# EAGLE design openSX70-dongle_v5-1-dual-led (EAGLE 9.4.2)
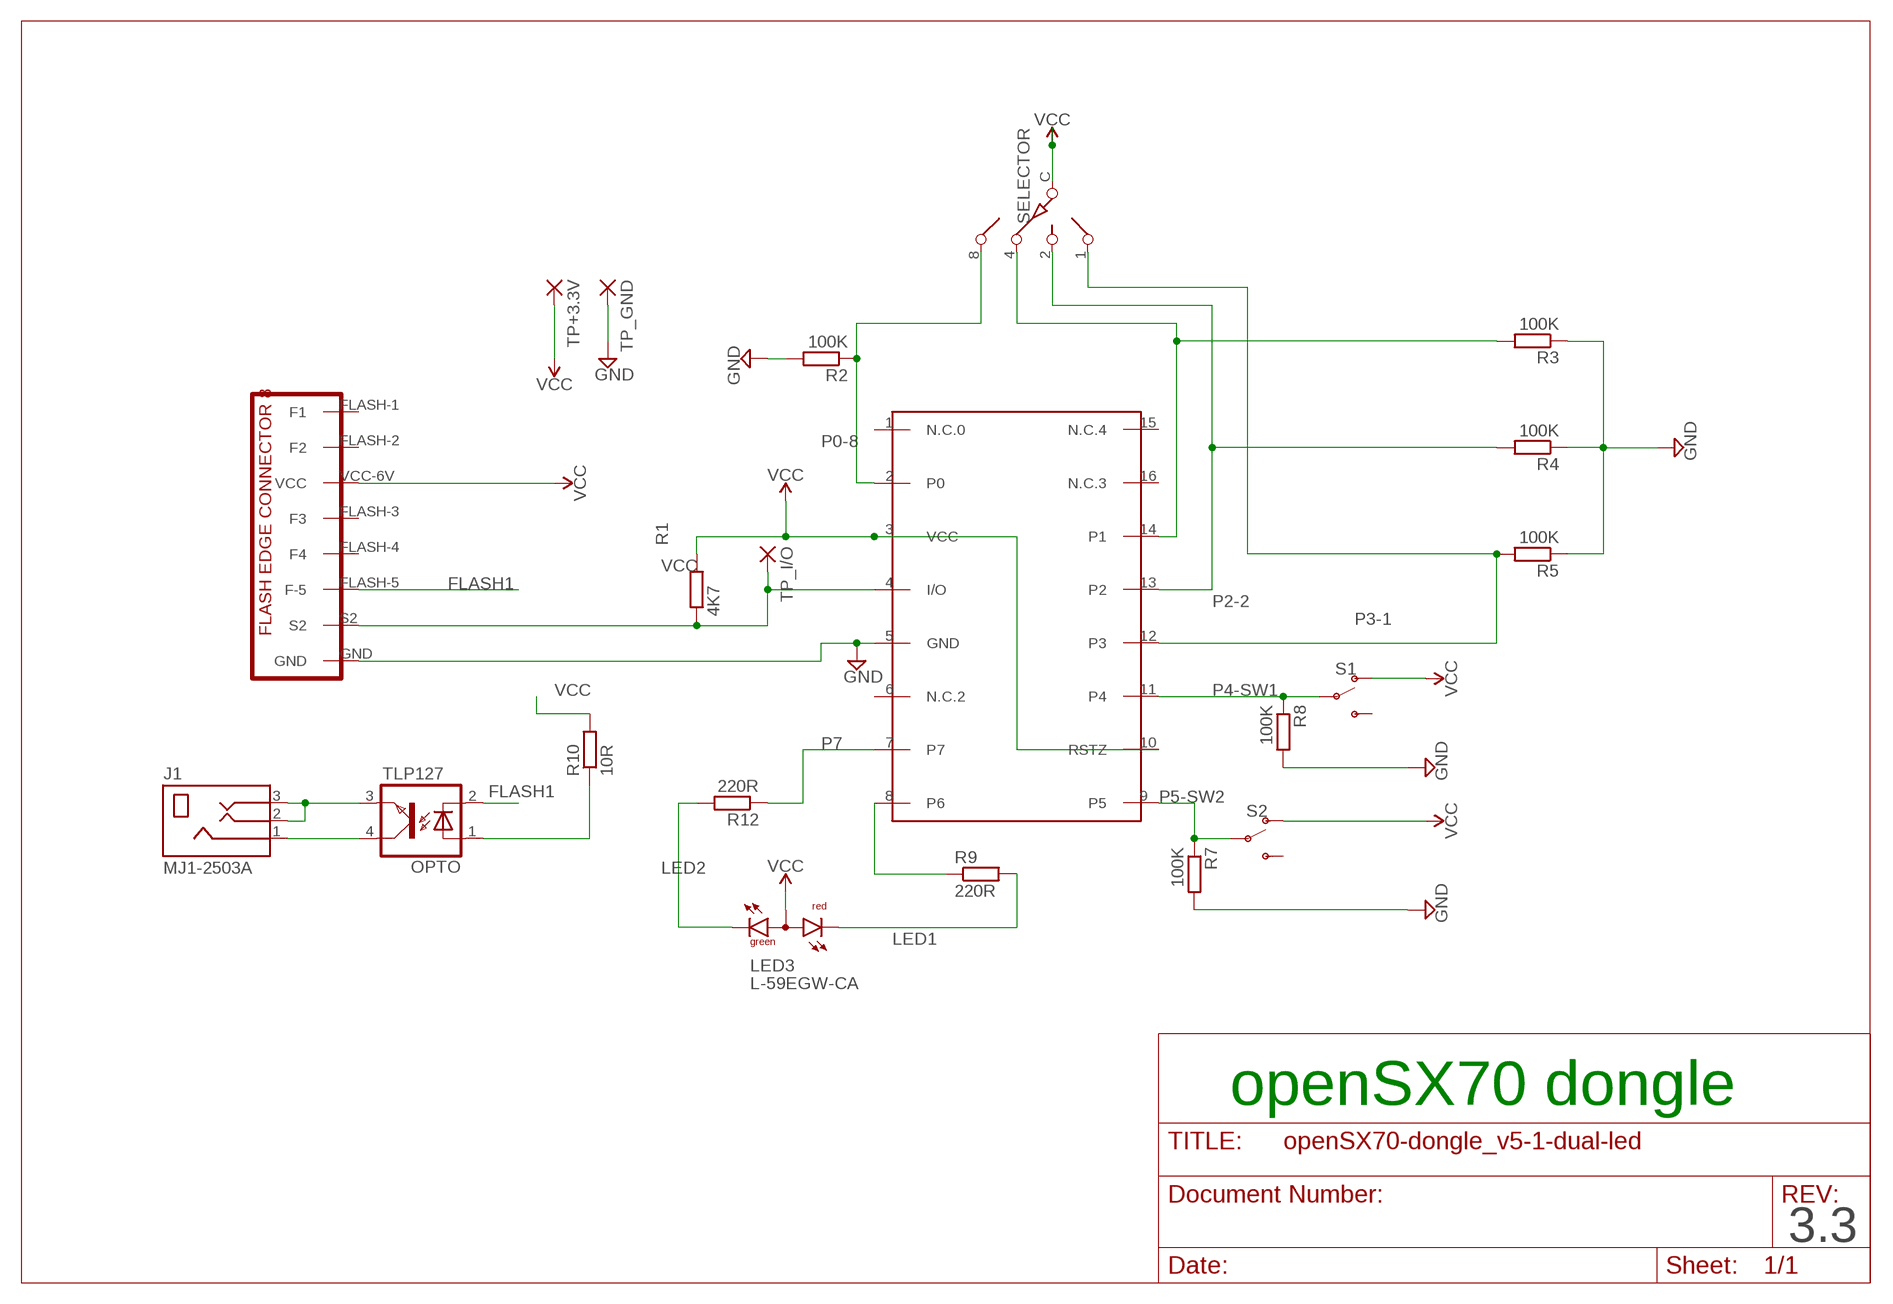
[diagram p0: schematic, sheet 1]

## Parts
DS2408  DS2408  [SO16]
J1  MJ1-2503A  [CUI_MJ1-2503A]
LED3  L-59EGW-CA  [L-59EGW-CA]
OPTO  TLP127  [SO-4]
R1  4K7  R-EU_R0603  [R0603]
R2  100K  R-EU_R0603  [R0603]
R3  100K  R-EU_R0603  [R0603]
R4  100K  R-EU_R0603  [R0603]
R5  100K  R-EU_R0603  [R0603]
R7  100K  R-EU_R0603  [R0603]
R8  100K  R-EU_R0603  [R0603]
R9  220R  R-EU_R0603  [R0603]
R10  10R  R-EU_R0603  [R0603]
R12  220R  R-EU_R0603  [R0603]
S1  SWITCH-SPDT-SMD-RIGHT-ANGLE  [SWITCH_SPST_SMD_A]
S2  SWITCH-SPDT-SMD-RIGHT-ANGLE  [SWITCH_SPST_SMD_A]
SELECTOR  SW-C16  [SW-C16]
TP+3.3V  SMD2  [SMD1,27-2,54]
TP_GND  SMD2  [SMD1,27-2,54]
TP_I/O  SMD2  [SMD1,27-2,54]
U$2  SX70-FLASH-EDGE8-MALE-PROPER  [SX70-FLASH-EDGE8]

## Nets
FLASH1: OPTO.2(C) U$2.FLASH-5(F-5)
GND: DS2408.5(GND) R2.2 R3.1 R4.1 R5.1 R7.2 R8.2 TP_GND.1(P) U$2.GND
LED1: LED3.1(CR) R9.2
LED2: LED3.3(CG) R12.2
N$9: J1.1 OPTO.4(COL)
N$12: OPTO.1(A) R10.1
N$15: J1.2 J1.3 OPTO.3(EMIT)
P0-8: DS2408.2(P0) R2.1 SELECTOR.8
P1-4: DS2408.14(P1) R3.2 SELECTOR.4
P2-2: DS2408.13(P2) R4.2 SELECTOR.2
P3-1: DS2408.12(P3) R5.2 SELECTOR.1
P4-SW1: DS2408.11(P4) R8.1 S1.2(P)
P5-SW2: DS2408.9(P5) R7.1 S2.2(P)
P6: DS2408.8(P6) R9.1
P7: DS2408.7 R12.1
S2+: DS2408.4(I/O) R1.1 TP_I/O.1(P) U$2.S2
VCC: DS2408.3(VCC) DS2408.10(RSTZ) LED3.2(A) R1.2 R10.2 S1.1(O) S2.1(O) SELECTOR.C TP+3.3V.1(P) U$2.VCC-6V(VCC)
Unconnected: DS2408.1(N.C.0) DS2408.6(N.C.2) DS2408.15(N.C.4) DS2408.16(N.C.3) S1.3(S) S2.3(S) U$2.FLASH-1(F1) U$2.FLASH-2(F2) U$2.FLASH-3(F3) U$2.FLASH-4(F4)

## Notes on the sheet
- openSX70 dongle
- 3.3

## Library data of the parts
DS2408 = DS2408-joaco:DS2408
J1 = MJ1-2503A:MJ1-2503A: 2.5 mm, Mono, Right Angle, Through Hole, Audio Jack Connector; CUI_PURCHASE_URL: https://www.cui.com/product/interconnect/connectors/audio-connectors/jacks/mj1-2503a?utm_source=snapeda.com&utm_medium=referral&utm_campaign=snapedaBOM; DESCRIPTION: 2.5 mm, Mono, Right Angle, Through Hole, Audio Jack Connector; DIGI-KEY_PART_NUMBER: CP1-2503AM-ND; DIGI-KEY_PURCHASE_URL: https://www.digikey.com/product-detail/en/cui-inc/MJ1-2503A/CP1-2503AM-ND/738679?utm_source=snapeda&utm_medium=aggregator&utm_campaign=symbol; MF: CUI Inc.; MP: MJ1-2503A; PACKAGE: None
LED3 = led:L-59EGW-CA: T-1 3/4 (5mm) BI-COLOR INDICATOR LAMP Source: http://www.kingbright.com/manager/upload/pdf/L-59EGW-CA%28Ver1292805989.13%29
OPTO = openSX70:TLP127
R1-R5 R7-R9 R12 = rcl:R-EU_: RESISTOR, European symbol; SPICEPREFIX: R
R10 = resistor:R-EU_: RESISTOR, European symbol
S1 S2 = SparkFun-Switches:SWITCH-SPDT: Single Pole, Double Throw (SPDT) Switch Single-pole, double-throw (SPDT) switch. Variant Overview SMD-AYZ0202 Surface Mount DPDT Switch <https://www.sparkfun.com/products/597> (COM-00597) Used on e.g. LilyPad Arduino USB - ATmega32U4 Board <https://www.sparkfun.com/products/12049> PTH-11.6X4.0MM SPDT Mini Power Switch <https://www.sparkfun.com/products/102> (COM-00102) Used on e.g. SparkFun Simon Says - Through-Hole Soldering Kit <https://www.sparkfun.com/products/10547> (KIT-10547) PTH-11.6X4.0MM-KIT KIT version of SPDT Mini Power Switch - Simplifies soldering by removing tStop of switch pins - only one side can be soldered. PTH-11.6X4.0MM-LOCK LOCK version of SPDT Mini Power Switch - Offset pins hold switch in place for easier soldering. SMD-RIGHT-ANGLE Surface Mount Right Angle Switch <https://www.sparkfun.com/products/10860> (COM-10860) Used on e.g. SparkFun ESP8266 Thing <https://www.sparkfun.com/products/13231>; PROD_ID: SWCH-10651; SF_SKU: COM-10860
SELECTOR = special:SW-C16: SWITCH 16-step rotary switch
TP+3.3V TP_GND TP_I/O = wirepad:SMD2: SMD PAD
U$2 = _openSX70:SX70-FLASH-EDGE8-MALE-PROPER

## Net classes
0 GND: width 0.305 mm
1 VCC: width 0.254 mm
2 2.8V: width 0.254 mm

## Board
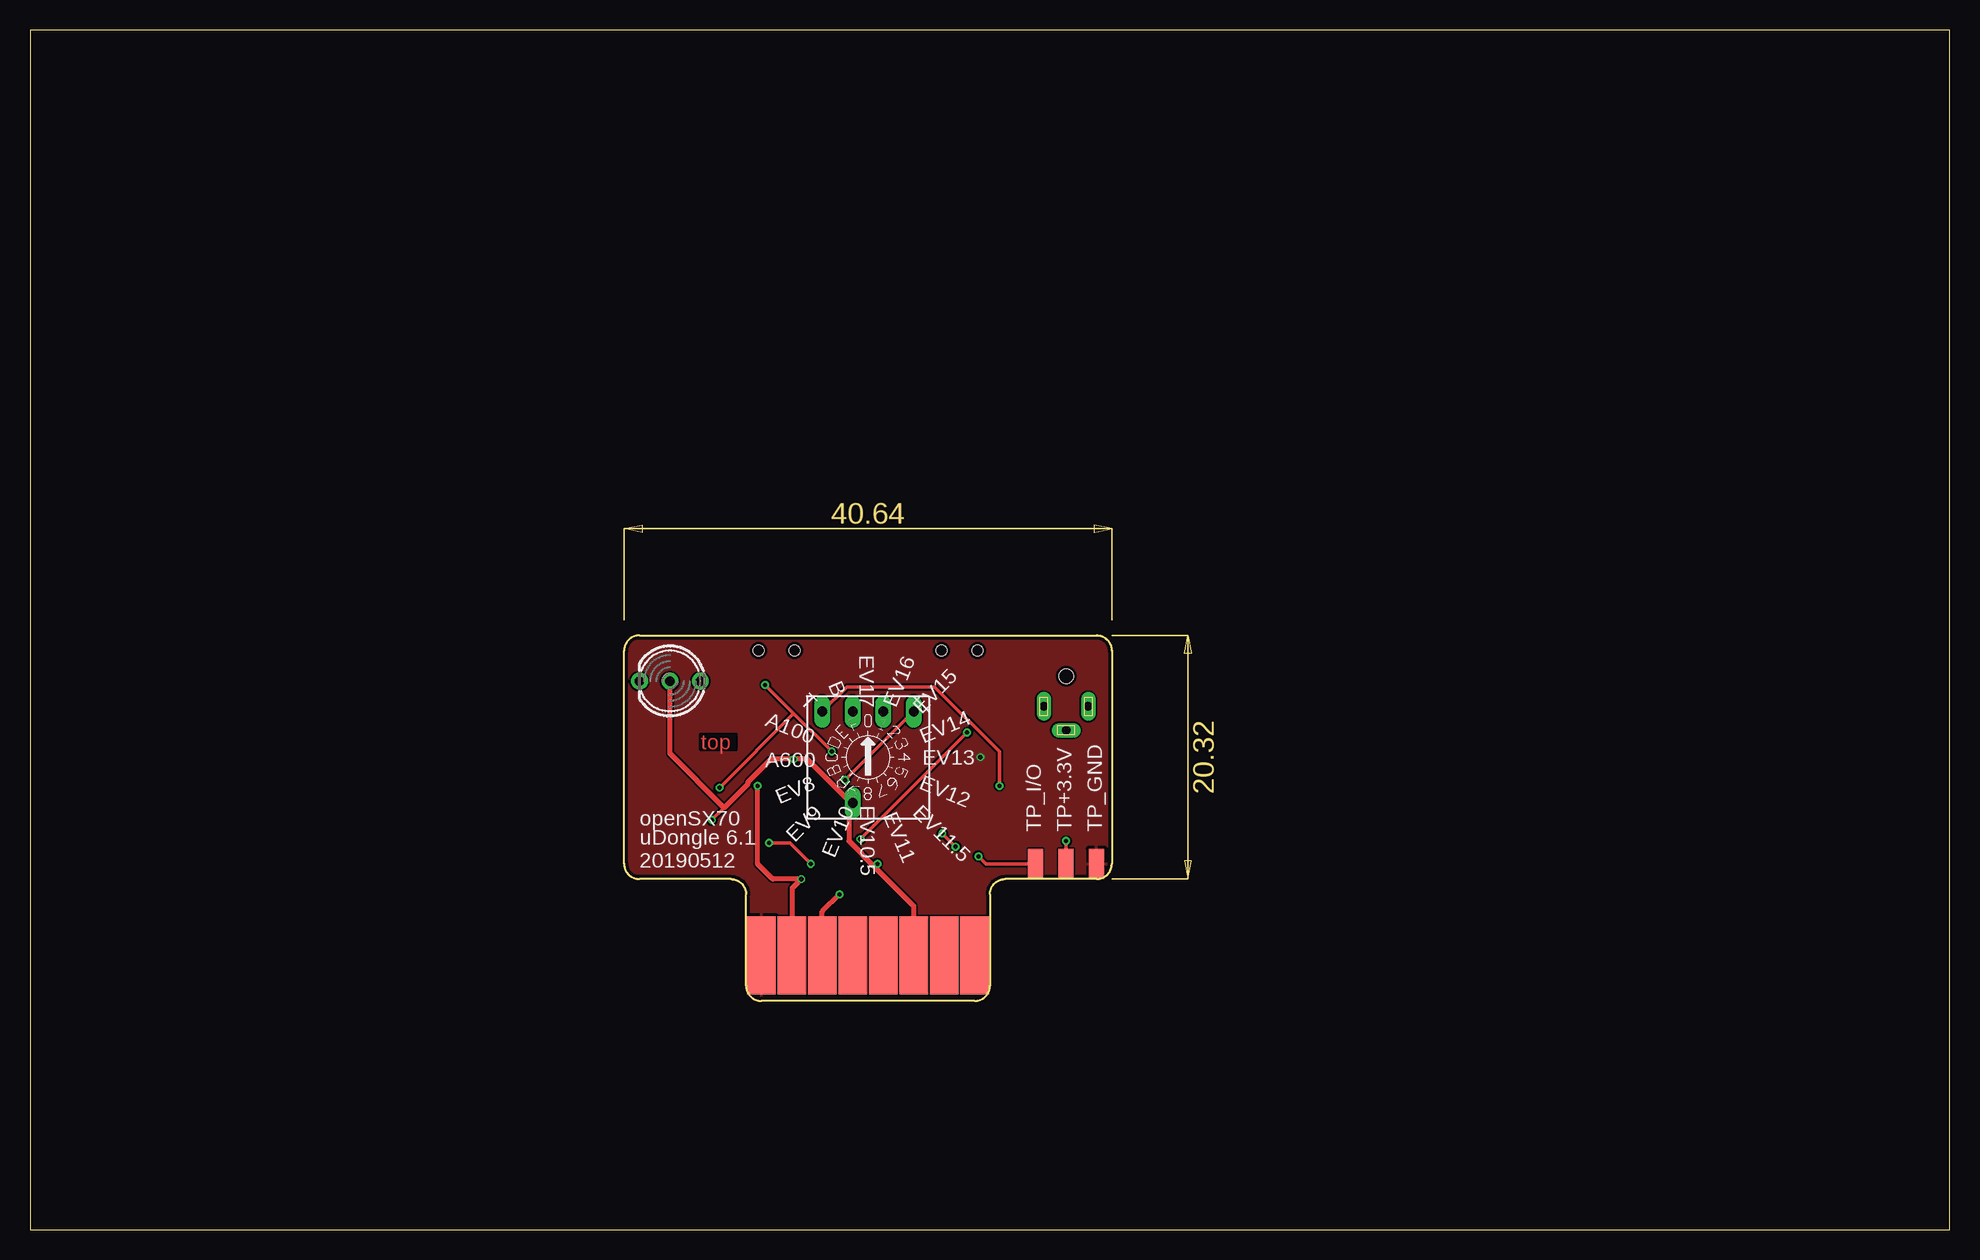
[diagram p1: board, top side]
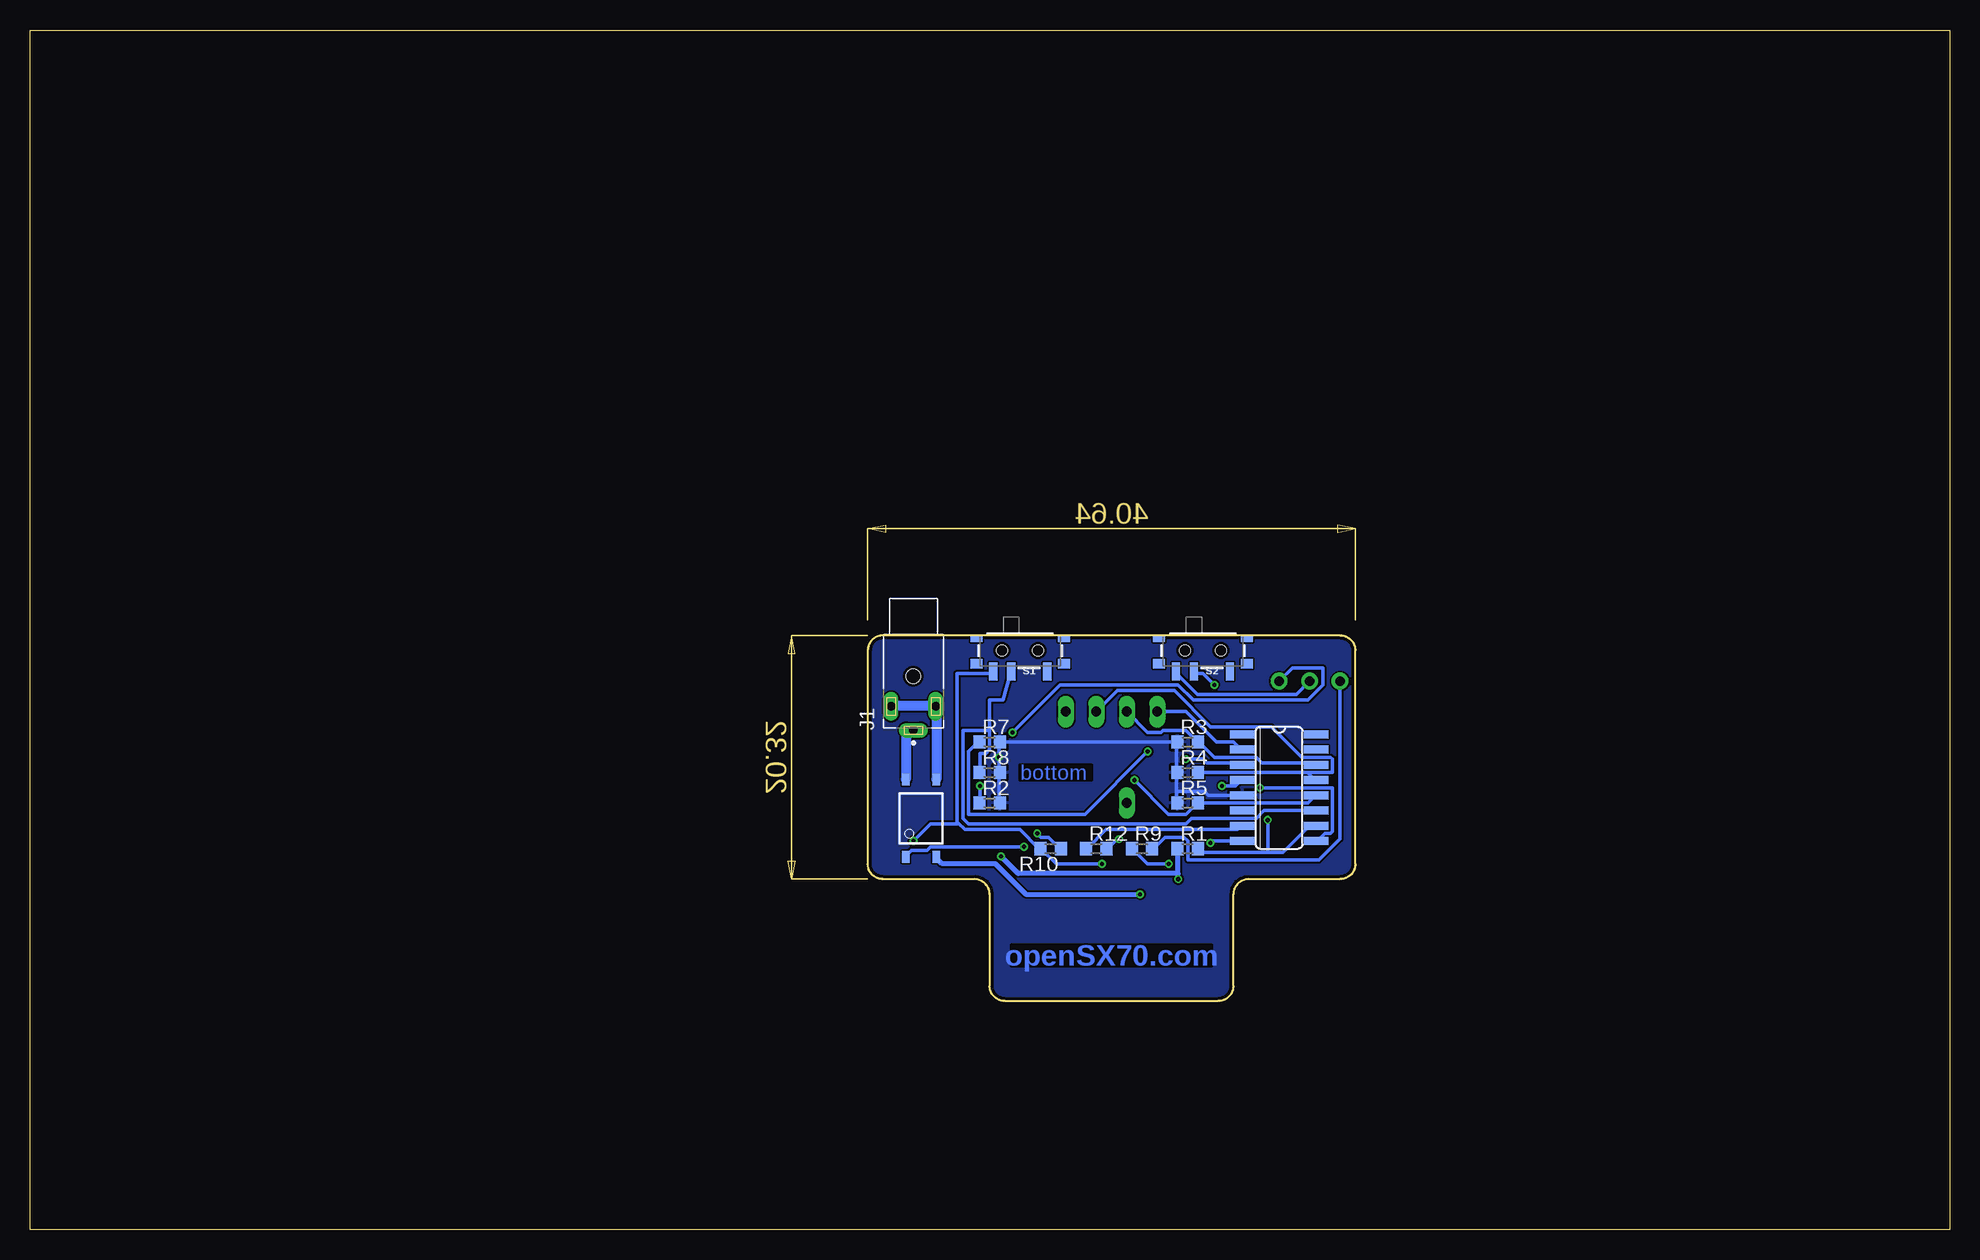
[diagram p2: board, bottom side, seen from below]

Size 160 x 100 mm. Coordinates in mm from the lower left corner, seen from the top.
Outline: 0,0 160,0 160,100 0,100 0,0
Outline: 50.8,49.53 88.9,49.53 arc-90 90.17,48.26 90.17,30.48 arc-90 88.9,29.21 81.28,29.21 arc90 80.01,27.94 80.01,20.32 arc-90 78.74,19.05 60.96,19.05 arc-90 59.69,20.32 59.69,27.94 arc90 58.42,29.21 50.8,29.21 arc-90 49.53,30.48 49.53,48.26 arc-90 50.8,49.53
Copper layers (1*16): Top 0.035mm / dielectric 1.5mm / Bottom 0.035mm
Design rules "SeeedStudio_2layer_DRU_no_angle_20140221": minimum track width 6mil, minimum drill 12mil, track to track 6mil, track to pad 6mil, pad to pad 6mil, via to via 6mil, smd to smd 0mil, copper to edge 10mil, drill to drill 10mil, minimum pad ring 10mil, minimum via ring 6mil, stop-mask expansion 2mil, vias tented up to drill 100mil, thermal gap 10mil

### Footprints (pad centres in the part's own frame; a part is rotated, then mirrored left to right if it is on the bottom)
SO16 = smd 0.66 x 2.032: 1 -4.445,-3.073; 2 -3.175,-3.073; 3 -1.905,-3.073; 4 -0.635,-3.073; 5 0.635,-3.073; 6 1.905,-3.073; 7 3.175,-3.073; 8 4.445,-3.073; 9 4.445,3.073; 10 3.175,3.073; 11 1.905,3.073; 12 0.635,3.073; 13 -0.635,3.073; 14 -1.905,3.073; 15 -3.175,3.073; 16 -4.445,3.073
CUI_MJ1-2503A = drill 0.7 long: 1 -4.1,0; 2 -2.1,1.85; 3 -2.1,-1.85 | hole 1.2: 0.4,0
L-59EGW-CA = drill 0.8 pad 1.4: 1 0,2.54; 2 0,0; 3 0,-2.54
SO-4 = smd 1 x 0.6: 1 -3.24,0.635; 2 -3.24,-1.905; 3 3.24,-1.905; 4 3.24,0.635
R0603 = smd 1 x 1.1: 1 -0.85,0; 2 0.85,0
SWITCH_SPST_SMD_A = smd 0.7 x 1.5: 1 -2.25,-1.75; 2 -0.75,-1.75; 3 2.25,-1.75 | smd 1 x 0.6: GND1 -3.65,1; GND3 3.65,1 | smd 1 x 0.8: GND2 -3.65,-1.1; GND4 3.65,-1.1 | hole 0.9: -1.5,0; 1.5,0
SW-C16 = drill 0.813 long: 1 -3.81,-3.81; 2 -1.27,-3.81; 4 1.27,-3.81; 8 3.81,-3.81; C 1.27,3.81
SMD1,27-2,54 = smd 1.27 x 2.54: 1 0,0
SX70-FLASH-EDGE8 = smd 2.4 x 6.502: FLASH-1 8.89,0.001; FLASH-2 6.35,0.001; FLASH-3 1.27,0.001; FLASH-4 -1.27,0.001; FLASH-5 -3.81,0.001; GND -8.89,0.001; S2 -6.35,0.001; VCC-6V 3.81,0.001

### Placement (x,y rotation side)
DS2408  55.88,36.83 270 bottom
J1  86.36,45.72 90 bottom
LED3  53.34,45.72 90 top
OPTO  86.36,34.29 90 bottom
R1  63.5,31.75 0 bottom
R2  80.01,35.56 0 bottom
R3  63.5,40.64 0 bottom
R4  63.5,38.1 0 bottom
R5  63.5,35.56 0 bottom
R7  80.01,40.64 0 bottom
R8  80.01,38.1 0 bottom
R9  67.31,31.75 0 bottom
R10  74.93,31.75 180 bottom
R12  71.12,31.75 0 bottom
S1  77.47,48.26 0 bottom
S2  62.23,48.26 0 bottom
SELECTOR  69.85,39.37 180 top
TP+3.3V  86.36,30.48 0 top
TP_GND  88.9,30.48 180 top
TP_I/O  83.82,30.48 0 top
U$2  69.85,22.86 0 top

### Tracks (layer width: path | path; a pad name or v marks a point on that pad's centre or on a via)
FLASH1  (via drill 0.35)
  Top 0.305: 66.04,23.02 U$2.FLASH-5
  Top 0.406: v67.47,27.94 66.04,26.51 66.04,23.02
  Bottom 0.305: 84.45,30.96 OPTO.2
  Bottom 0.406: 84.45,30.96 83.98,30.48 79.53,30.48 76.99,27.94 v67.47,27.94
GND  (via drill 0.35)
  Bottom 0.305: 79.22,38.1 79.22,35.56 R2.2 | 79.22,38.1 v79.22,39.37 79.22,40.64 R7.2 64.45,40.64 | 79.22,38.1 R8.2 | 64.45,38.1 64.45,36.51 | 64.45,36.51 64.45,35.56 R5.1 | 64.45,38.1 64.45,40.64 | 64.45,38.1 R4.1 | DS2408.5 61.75,36.2 62.07,36.51 64.45,36.51 | 64.45,40.64 R3.1
  pour Bottom: 49.53,49.53 90.17,49.53 90.17,29.21 80.01,29.21 80.01,19.05 59.69,19.05 59.69,29.21 49.53,29.21
  pour Top: 49.53,49.53 90.17,49.53 90.17,29.21 80.01,29.21 80.01,19.05 59.69,19.05 59.69,29.21 49.53,29.21
  pour Bottom: 49.53,49.53 90.17,49.53 90.17,29.21 80.01,29.21 80.01,19.05 59.69,19.05 59.69,29.21 49.53,29.21
LED1
  Bottom 0.305: LED3.1 50.8,32.54 52.55,30.8 63.5,30.8 63.5,32.38 63.82,32.7 65.41,32.7 66.36,31.75 R9.2
LED2  (via drill 0.35)
  Top 0.305: v78.11,41.43 v69.22,32.54
  Bottom 0.305: v69.22,32.54 69.37,32.54 70.17,31.75 R12.2 | v78.11,41.43 74.14,45.4 64.29,45.4 63.02,44.13 53.5,44.13 52.23,45.4 52.23,46.83 54.77,46.83 LED3.3
N$9
  Bottom 0.305: 86.36,41.59 J1.1
  Bottom 0.813: OPTO.4 87,41.59 86.36,41.59
N$12  (via drill 0.35)
  Top 0.305: v76.04,33.02 v77.15,31.91
  Bottom 0.305: v77.15,31.91 84.93,31.91 85.25,31.59 86.52,31.59 87,31.11 OPTO.1 | v76.04,33.02 75.72,32.7 75.09,32.7 74.14,31.75 R10.1
N$15
  Bottom 0.305: 84.45,43.5 J1.3 84.61,43.66 | 88.11,43.66 J1.2
  Bottom 0.813: 84.45,43.5 OPTO.3 | 84.61,43.66 88.11,43.66
P0-8  (via drill 0.35)
  Top 0.305: v80.8,36.99 80.8,39.85 75.41,45.24 68.1,45.24 SELECTOR.8
  Bottom 0.305: v80.8,36.99 80.8,35.56 R2.1 | SELECTOR.8 63.66,43.18 61.12,40.64 59.69,40.64 59.05,40.01 DS2408.2
P1-4
  Bottom 0.305: SELECTOR.4 66.83,41.43 65.72,41.43 65.56,41.59 63.66,41.59 62.71,40.64 R3.2 62.55,40.64 61.28,39.37 57.78,39.37 57.31,38.89 53.02,38.89 52.86,38.73 DS2408.14
P2-2
  Bottom 0.305: R4.2 53.5,38.1 53.42,38.02 | 53.42,38.02 52.86,37.47 DS2408.13 | SELECTOR.2 69.37,44.93 64.61,44.93 61.59,41.91 56.52,41.91 53.98,39.37 51.59,39.37 51.44,39.21 51.44,38.1 53.34,38.1 53.42,38.02
P3-1  (via drill 0.35)
  Top 0.305: v67.94,37.47 SELECTOR.1
  Bottom 0.305: DS2408.12 52.86,36.2 53.5,35.56 R5.2 62.71,35.56 63.66,34.61 65.09,34.61 v67.94,37.47
P4-SW1
  Bottom 0.305: 80.01,41.59 80.01,44.13 78.89,44.13 S1.2 | 80.01,41.59 80.01,40.01 80.33,39.69 80.8,39.69 80.8,38.1 R8.1 | DS2408.11 57.15,34.92 57.78,34.29 63.18,34.29 63.66,33.81 81.76,33.81 82.23,34.29 82.23,41.59 80.01,41.59
P5-SW2  (via drill 0.35)
  Top 0.305: v61.28,45.4 63.66,43.02 | 63.66,43.02 v66.83,39.85 | 63.66,43.02 v57.47,36.83
  Bottom 0.305: v66.83,39.85 72.07,34.61 81.76,34.61 81.76,39.85 80.96,40.64 R7.1 | v61.28,45.4 62.23,46.35 62.87,46.35 S2.2 | v57.47,36.83 51.44,36.83 51.44,33.18 51.59,33.02 52.07,33.02 52.7,32.38 DS2408.9
P6  (via drill 0.35)
  Top 0.305: v65.09,30.48 63.34,32.23 v61.59,32.23
  Bottom 0.305: v65.09,30.48 66.83,30.48 68.1,31.75 R9.1 | v61.59,32.23 61.44,32.38 DS2408.8
P7
  Bottom 0.305: R12.1 71.91,31.75 70.33,33.34 59.37,33.34 59.05,33.66 DS2408.7
S2+  (via drill 0.35)
  Top 0.305: 63.53,23.05 63.5,23.02 U$2.S2 | TP_I/O.1 79.69,30.48 v79.06,31.11
  Top 0.406: 63.53,23.05 63.53,28.45 v64.29,29.21 61.91,29.21 60.64,30.48 v60.64,36.99
  Bottom 0.305: 64.29,31.75 R1.1 | v60.64,36.99 59.53,36.99 59.05,37.47 DS2408.4
  Bottom 0.406: v64.29,29.21 64.29,29.69 | 64.29,29.69 64.29,31.75 | v79.06,31.11 77.63,29.69 64.29,29.69
VCC  (via drill 0.35)
  Top 0.305: v86.36,32.38 TP+3.3V.1 | SELECTOR.C 68.42,35.56 | 57.86,35.16 v56.83,34.13 | 70.41,30.24 v70.64,30.48
  Top 0.406: 68.42,35.56 64.77,39.21 v63.66,39.21 61.75,39.21 59.85,37.31 59.85,37.15 57.86,35.16 53.34,39.69 LED3.2 | U$2.VCC-6V 73.66,26.99 70.41,30.24 68.26,32.38 68.26,35.56 SELECTOR.C
  Bottom 0.305: 82.63,33.89 82.71,33.97 82.71,46.35 79.85,46.35 S1.1 | 82.63,33.89 82.07,33.34 77.47,33.34 75.88,31.75 R10.2 75.72,31.75 74.45,30.48 v70.64,30.48 | v86.36,32.38 84.93,33.81 82.71,33.81 82.63,33.89 | LED3.2 54.45,44.61 62.71,44.61 64.45,46.35 S2.1 | 56.83,31.43 55.56,31.43 53.34,33.66 DS2408.10 | 56.83,31.43 62.23,31.43 62.55,31.75 R1.2 | v63.66,39.21 62.23,39.21 61.91,38.89 59.21,38.89 59.05,38.73 DS2408.3 | v56.83,34.13 56.83,31.43

### Text on the board
Top: top
Bottom: bottom | openSX70.com
tNames: EV12 | EV14 | EV11.5 | EV15 | EV11 | EV16 | EV10.5 | EV17 | EV10 | EV13 | B | EV9 | T | EV8 | A100 | A600 | openSX70 | uDongle 6.1 / 20190512